# EAGLE schematic chart3 (EAGLE 7.6.0)
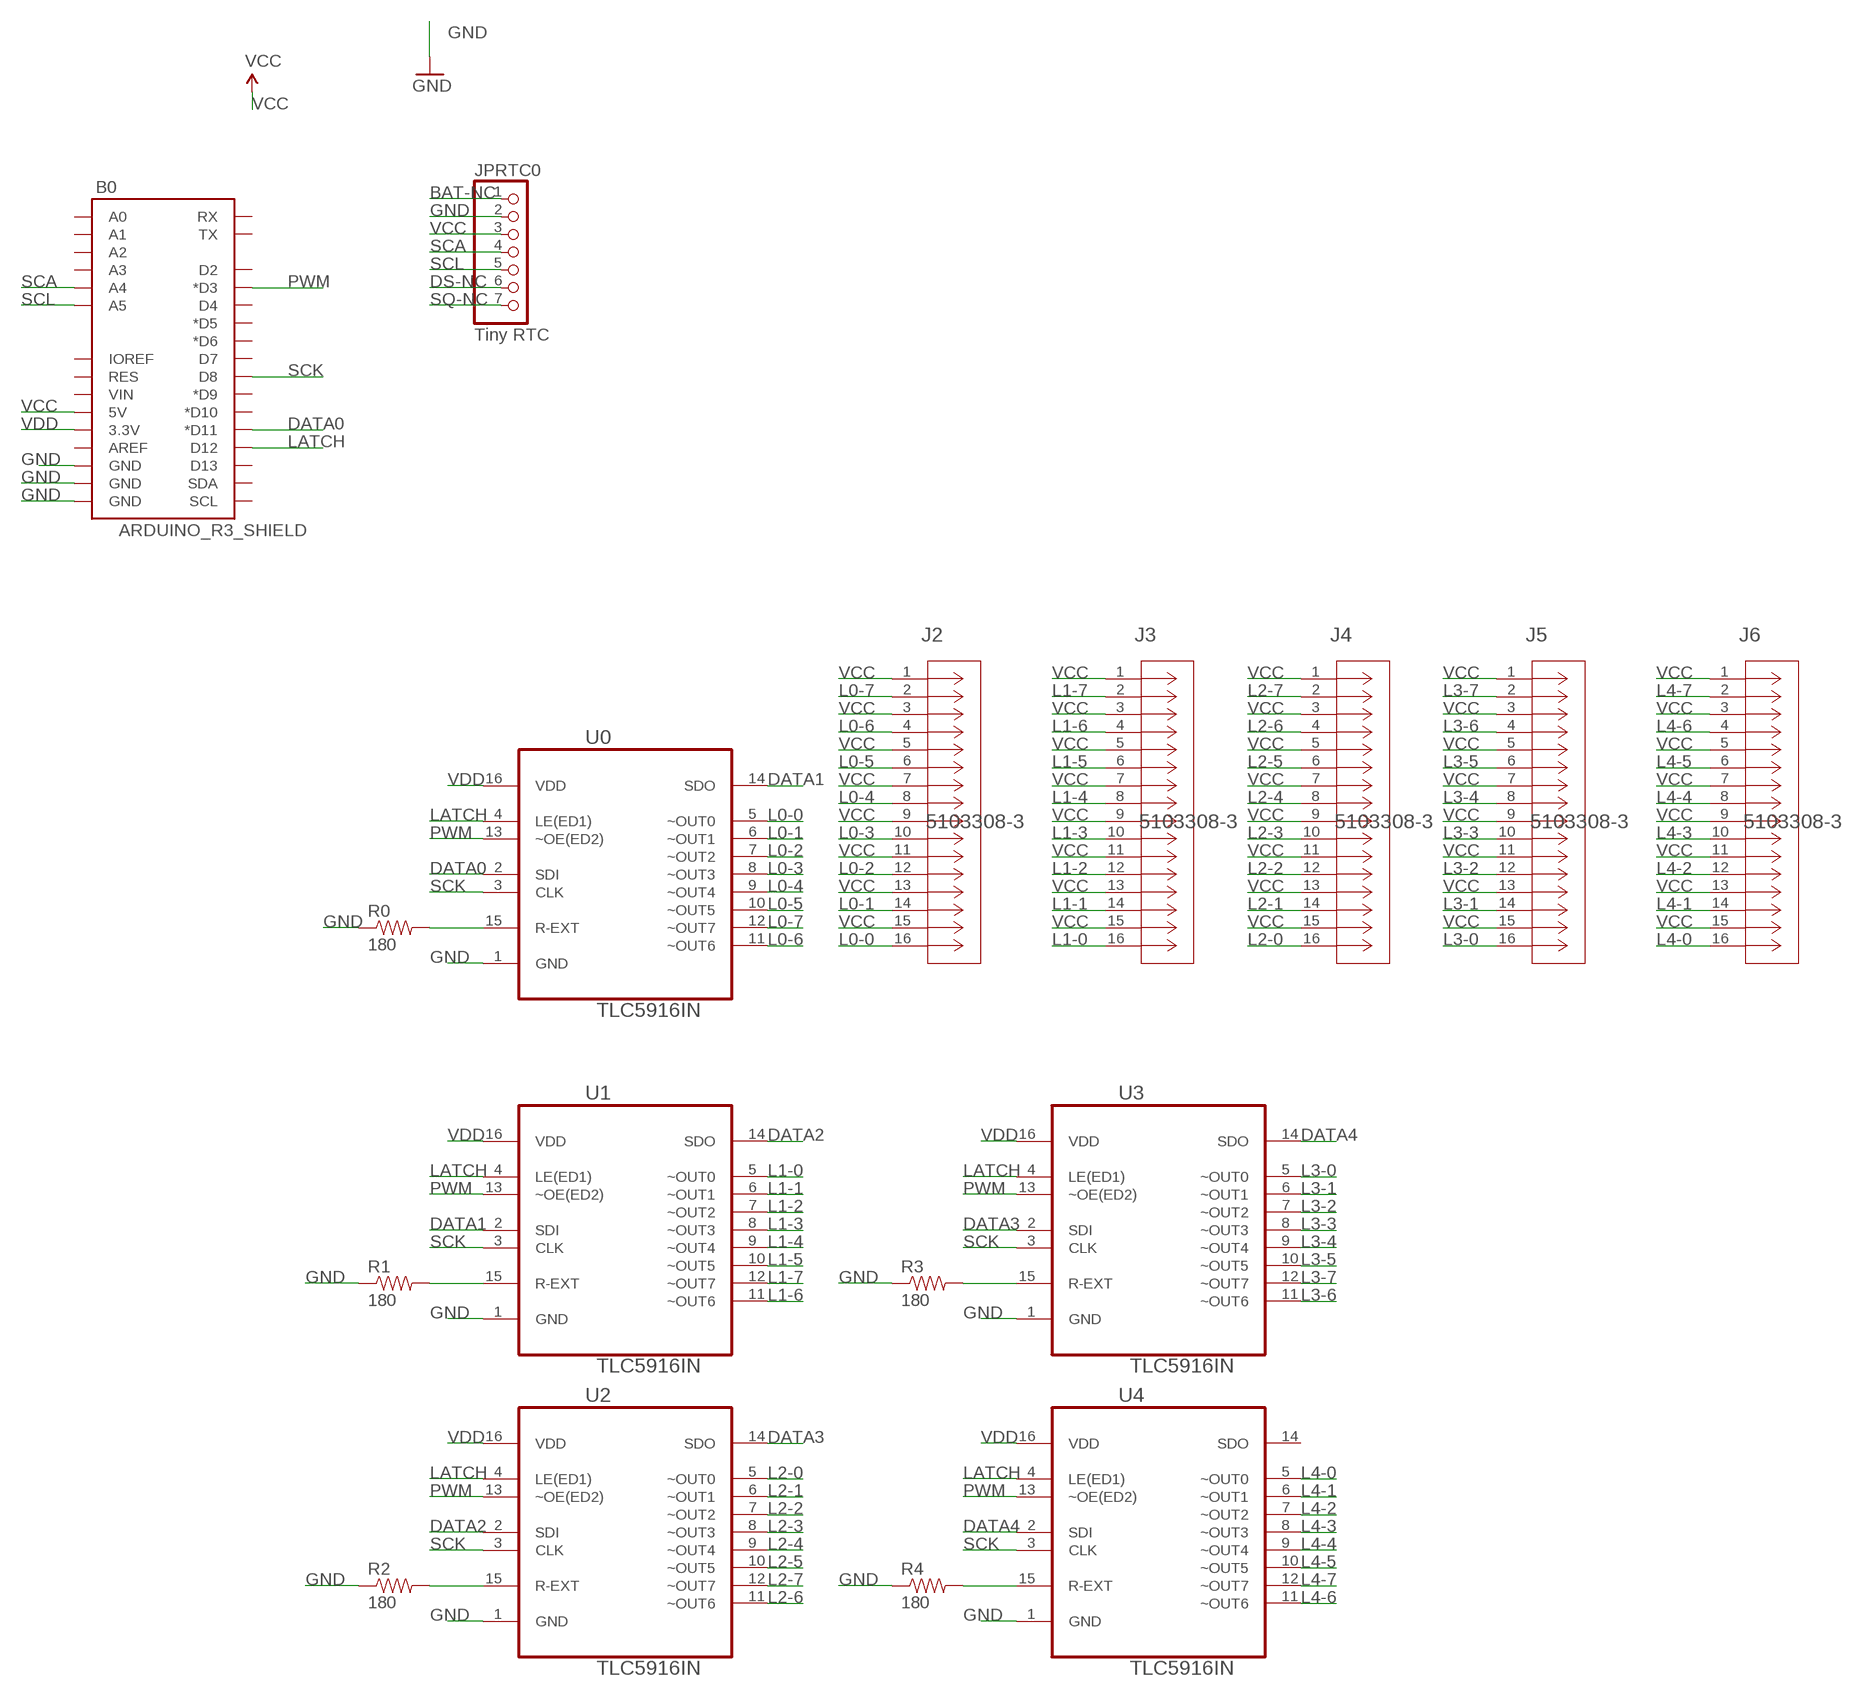
[diagram p0: schematic, sheet 1]

## Parts
B0  ARDUINO_R3_SHIELD  [UNO_R3_SHIELD]
J2  5103308-3  [CON16_2X8_S4]
J3  5103308-3  [CON16_2X8_S4]
J4  5103308-3  [CON16_2X8_S4]
J5  5103308-3  [CON16_2X8_S4]
J6  5103308-3  [CON16_2X8_S4]
JPRTC0  Tiny RTC  PINHD-1X7  [1X07]
R0  180  RESISTORPTH-1/4W  [AXIAL-0.4]
R1  180  RESISTORPTH-1/4W  [AXIAL-0.4]
R2  180  RESISTORPTH-1/4W  [AXIAL-0.4]
R3  180  RESISTORPTH-1/4W  [AXIAL-0.4]
R4  180  RESISTORPTH-1/4W  [AXIAL-0.4]
U0  TLC5916IN  [DIP254P762X508-16]
U1  TLC5916IN  [DIP254P762X508-16]
U2  TLC5916IN  [DIP254P762X508-16]
U3  TLC5916IN  [DIP254P762X508-16]
U4  TLC5916IN  [DIP254P762X508-16]

## Nets
BAT-NC: JPRTC0.1
DATA0: B0.D11(*D11) U0.2(SDI)
DATA1: U0.14(SDO) U1.2(SDI)
DATA2: U1.14(SDO) U2.2(SDI)
DATA3: U2.14(SDO) U3.2(SDI)
DATA4: U3.14(SDO) U4.2(SDI)
DS-NC: JPRTC0.6
GND [ground]: B0.GND@0(GND) B0.GND@1(GND) B0.GND@2(GND) JPRTC0.2 R0.P$1 R1.P$1 R2.P$1 R3.P$1 R4.P$1 U0.1(GND) U1.1(GND) U2.1(GND) U3.1(GND) U4.1(GND)
L0-0: J2.16 U0.5(~OUT0)
L0-1: J2.14 U0.6(~OUT1)
L0-2: J2.12 U0.7(~OUT2)
L0-3: J2.10 U0.8(~OUT3)
L0-4: J2.8 U0.9(~OUT4)
L0-5: J2.6 U0.10(~OUT5)
L0-6: J2.4 U0.11(~OUT6)
L0-7: J2.2 U0.12(~OUT7)
L1-0: J3.16 U1.5(~OUT0)
L1-1: J3.14 U1.6(~OUT1)
L1-2: J3.12 U1.7(~OUT2)
L1-3: J3.10 U1.8(~OUT3)
L1-4: J3.8 U1.9(~OUT4)
L1-5: J3.6 U1.10(~OUT5)
L1-6: J3.4 U1.11(~OUT6)
L1-7: J3.2 U1.12(~OUT7)
L2-0: J4.16 U2.5(~OUT0)
L2-1: J4.14 U2.6(~OUT1)
L2-2: J4.12 U2.7(~OUT2)
L2-3: J4.10 U2.8(~OUT3)
L2-4: J4.8 U2.9(~OUT4)
L2-5: J4.6 U2.10(~OUT5)
L2-6: J4.4 U2.11(~OUT6)
L2-7: J4.2 U2.12(~OUT7)
L3-0: J5.16 U3.5(~OUT0)
L3-1: J5.14 U3.6(~OUT1)
L3-2: J5.12 U3.7(~OUT2)
L3-3: J5.10 U3.8(~OUT3)
L3-4: J5.8 U3.9(~OUT4)
L3-5: J5.6 U3.10(~OUT5)
L3-6: J5.4 U3.11(~OUT6)
L3-7: J5.2 U3.12(~OUT7)
L4-0: J6.16 U4.5(~OUT0)
L4-1: J6.14 U4.6(~OUT1)
L4-2: J6.12 U4.7(~OUT2)
L4-3: J6.10 U4.8(~OUT3)
L4-4: J6.8 U4.9(~OUT4)
L4-5: J6.6 U4.10(~OUT5)
L4-6: J6.4 U4.11(~OUT6)
L4-7: J6.2 U4.12(~OUT7)
LATCH: B0.D12 U0.4(LE(ED1)) U1.4(LE(ED1)) U2.4(LE(ED1)) U3.4(LE(ED1)) U4.4(LE(ED1))
N$1: R1.P$2 U1.15(R-EXT)
N$2: R2.P$2 U2.15(R-EXT)
N$3: R3.P$2 U3.15(R-EXT)
N$4: R4.P$2 U4.15(R-EXT)
N$6: R0.P$2 U0.15(R-EXT)
PWM: B0.D3(*D3) U0.13(~OE(ED2)) U1.13(~OE(ED2)) U2.13(~OE(ED2)) U3.13(~OE(ED2)) U4.13(~OE(ED2))
SCA: B0.A4 JPRTC0.4
SCK: B0.D8 U0.3(CLK) U1.3(CLK) U2.3(CLK) U3.3(CLK) U4.3(CLK)
SCL: B0.A5 JPRTC0.5
SQ-NC: JPRTC0.7
VCC [VCC]: B0.5V J2.1 J2.3 J2.5 J2.7 J2.9 J2.11 J2.13 J2.15 J3.1 J3.3 J3.5 J3.7 J3.9 J3.11 J3.13 J3.15 J4.1 J4.3 J4.5 J4.7 J4.9 J4.11 J4.13 J4.15 J5.1 J5.3 J5.5 J5.7 J5.9 J5.11 J5.13 J5.15 J6.1 J6.3 J6.5 J6.7 J6.9 J6.11 J6.13 J6.15 JPRTC0.3
VDD [VCC]: B0.3.3V U0.16(VDD) U1.16(VDD) U2.16(VDD) U3.16(VDD) U4.16(VDD)
Unconnected: B0.A0 B0.A1 B0.A2 B0.A3 B0.AREF B0.D2 B0.D4 B0.D5(*D5) B0.D6(*D6) B0.D7 B0.D9(*D9) B0.D10(*D10) B0.D13 B0.IOREF B0.RES B0.RX B0.SCL B0.SDA B0.TX B0.VIN U4.14(SDO)

## Library data of the parts
B0 = SparkFun-Boards:ARDUINO_R3_SHIELD: Shield form compatible with the Arduino Uno R3.
J2-J6 = 510308:5103308-3; CATEGORY: Connectors; COLOR: Black; CONNECTORTYPE: Header, Shrouded; CONTACTFINISH: Gold or Gold-Palladium; CONTACTFINISHTHICKNESS: 15µin (0.38µm); CONTACTMATINGLENGTH: 0.240" (6.10mm); CONTACTTYPE: Male Pin; COPYRIGHT: Copyright (C) 2015 Accelerated Designs. All rights reserved; DATASHEET: http://documents.tycoelectronics.com/commerce/DocumentDelivery/DDEController?Action=srchrtrv&ampDocNm=5103308&ampDocType=CD&ampDocLang=EN; DIGIKEYPARTNUMBER: A33163-ND; FASTENINGTYPE: -; FEATURES: -; MANUFACTURER_PART_NUMBER: 5103308-3; MOUNTINGTYPE: Through Hole; NUMBEROFCONTACTSLOADED: All; NUMBEROFPOSITIONS: 16; NUMBEROFPOSITIONSLOADED: All; NUMBEROFROWS: 2; PACKAGING: Tube; PITCH: 0.100" (2.54mm); QUANTITY_AVAILABLE: 16245; ROWSPACING: 0.100" (2.54mm); SERIES: AMP-Latch™; TERMINATION: Solder; VENDOR: Tyco Electronics
JPRTC0 = pinhead:PINHD-1X7: PIN HEADER
R0 R1-R4 = SparkFun-Resistors:RESISTOR: Resistor Basic schematic elements and footprints for 0603, 1206, and PTH resistors.
U0 U1-U4 = Texas Instruments_By_element14_Batch_1:TLC5916IN: 8-CHANNEL CONSTANT-CURRENT LED SINK DRIVERS; MPN: TLC5916IN; OC_FARNELL: 1647814; OC_NEWARK: 60M1749; PACKAGE: PDIP-16; SUPPLIER: Texas Instruments

## Net classes
0 default: width 0.254 mm, clearance 0.205 mm
1 ground: width 0.635 mm, clearance 0.205 mm to class 0, clearance 0.254 mm
2 VCC: width 0.635 mm, clearance 0.205 mm to class 0, clearance 0.205 mm to class 1, clearance 0.254 mm